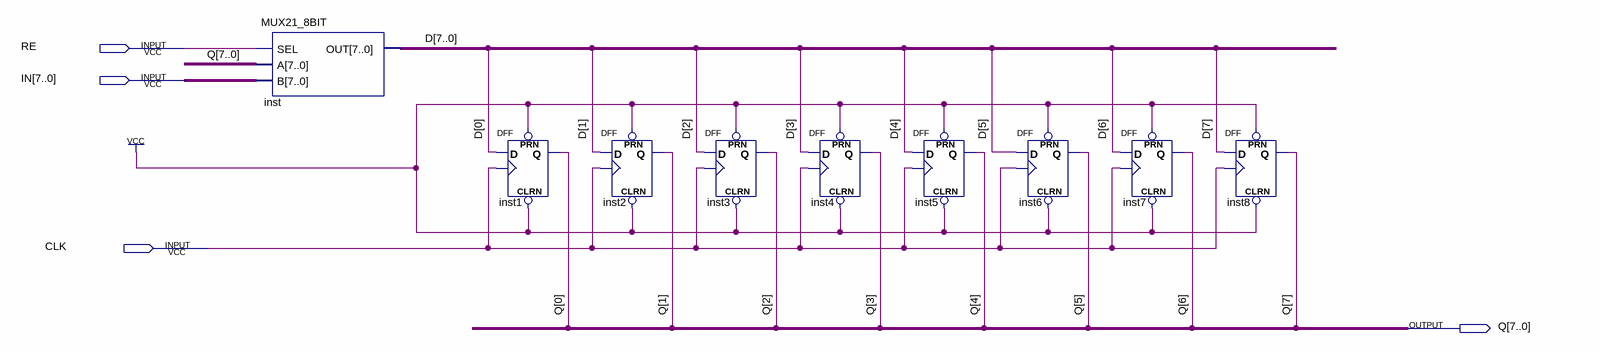
[diagram p0: schematic sheet]
// Quartus schematic REG.bdf as structural Verilog: 9 symbols, 4 pins
module REG (
  input  RE,
  input  [7:0] IN,
  input  CLK,
  output [7:0] Q
);

  wire [7:0] D;

  MUX21_8BIT inst (.SEL(RE), .A(Q), .B(IN), .OUT(D));
  DFF inst1 (.CLRN(1'b1), .CLK(CLK), .D(D[0]), .PRN(1'b1), .Q(Q[0]));
  DFF inst2 (.CLRN(1'b1), .CLK(CLK), .D(D[1]), .PRN(1'b1), .Q(Q[1]));
  DFF inst3 (.CLRN(1'b1), .CLK(CLK), .D(D[2]), .PRN(1'b1), .Q(Q[2]));
  DFF inst4 (.CLRN(1'b1), .CLK(CLK), .D(D[3]), .PRN(1'b1), .Q(Q[3]));
  DFF inst5 (.CLRN(1'b1), .CLK(CLK), .D(D[4]), .PRN(1'b1), .Q(Q[4]));
  DFF inst6 (.CLRN(1'b1), .CLK(CLK), .D(D[5]), .PRN(1'b1), .Q(Q[5]));
  DFF inst7 (.CLRN(1'b1), .CLK(CLK), .D(D[6]), .PRN(1'b1), .Q(Q[6]));
  DFF inst8 (.CLRN(1'b1), .CLK(CLK), .D(D[7]), .PRN(1'b1), .Q(Q[7]));
endmodule
